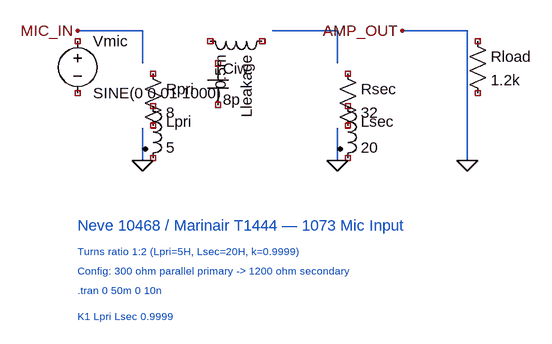
[diagram p0: schematic neve_1073_input.asc]
neve_1073_input.asc, the LTspice schematic file:
Version 4
SHEET 1 1200 680
* =============================================================================
* Neve 10468 / Marinair T1444 — LTspice reference model
* 1073 Mic Input Transformer
*
* Source: Neve Drawing EDO 71/13 (22/3/72) + Marinair Catalogue
* Cross-references: 10468 = VT22670 = T1454 = Carnhill VTB9045
*
* Electrical parameters:
*   Turns ratio   = 1:2 (config 300 ohm parallel -> 1200 ohm)
*   Z_primary     = 300 ohm
*   Z_secondary   = 1200 ohm
*   Gain          = +6 dB
*   Rdc_primary   ~ 8 ohm (estimated)
*   Rdc_secondary ~ 32 ohm (estimated)
*   Lp_primary    ~ 5 H
*   L_leakage     ~ 0.5 mH
*   C_interwinding ~ 8 pF
*
* Core: EI, NiFe 50% (Radiometal / Alloy 2), ungapped
*
* Frequency response: +/-0.3 dB, 20 Hz - 20 kHz
* THD: < 0.1% @ 40 Hz, < 0.01% @ 1 kHz+
* Max input: +10 dB @ 40 Hz
*
* Marinair T1444 catalogue specs:
*   Impedances: 1,200/300 : 5,000/1,250
*   Ratio: 1+1 : 2+2
* =============================================================================
WIRE 100 200 200 200
WIRE 200 200 200 250
WIRE 200 350 200 400
WIRE 400 200 500 200
WIRE 500 200 500 250
WIRE 500 350 500 400
WIRE 600 200 700 200
WIRE 700 200 700 400
FLAG 200 400 0
FLAG 500 400 0
FLAG 700 400 0
FLAG 100 200 MIC_IN
FLAG 600 200 AMP_OUT
SYMBOL voltage 100 200 R0
SYMATTR InstName Vmic
SYMATTR Value SINE(0 0.01 1000)
SYMATTR SpiceLine Rser=300
SYMBOL res 200 250 R0
SYMATTR InstName Rpri
SYMATTR Value 8
SYMBOL ind2 200 300 R0
SYMATTR InstName Lpri
SYMATTR Value 5
SYMBOL ind2 500 300 R0
SYMATTR InstName Lsec
SYMATTR Value 20
SYMBOL res 500 250 R0
SYMATTR InstName Rsec
SYMATTR Value 32
SYMBOL cap 300 250 R0
SYMATTR InstName Ciw
SYMATTR Value 8p
SYMBOL ind 400 200 R90
SYMATTR InstName Lleakage
SYMATTR Value 0.5m
SYMBOL res 700 200 R0
SYMATTR InstName Rload
SYMATTR Value 1.2k
TEXT 100 500 Left 2 ;Neve 10468 / Marinair T1444 — 1073 Mic Input
TEXT 100 540 Left 1 ;Turns ratio 1:2 (Lpri=5H, Lsec=20H, k=0.9999)
TEXT 100 570 Left 1 ;Config: 300 ohm parallel primary -> 1200 ohm secondary
TEXT 100 600 Left 1 ;.tran 0 50m 0 10n
TEXT 100 640 Left 1 ;K1 Lpri Lsec 0.9999

The netlist it stands for:
* neve_1073_input.asc
Vmic NC_01 NC_02 SINE(0 0.01 1000) Rser=300
Rpri NC_03 NC_04 8
Lpri NC_05 NC_06 5
Lsec NC_07 NC_08 20
Rsec NC_09 NC_10 32
Ciw NC_11 NC_12 8p
Lleakage NC_13 NC_14 0.5m
Rload NC_15 NC_16 1.2k
* Neve 10468 / Marinair T1444 — 1073 Mic Input
* Turns ratio 1:2 (Lpri=5H, Lsec=20H, k=0.9999)
* Config: 300 ohm parallel primary -> 1200 ohm secondary
* .tran 0 50m 0 10n
* K1 Lpri Lsec 0.9999
.backanno
.end